# EAGLE design WaterMonitorV5.0 (EAGLE 7.4.0)
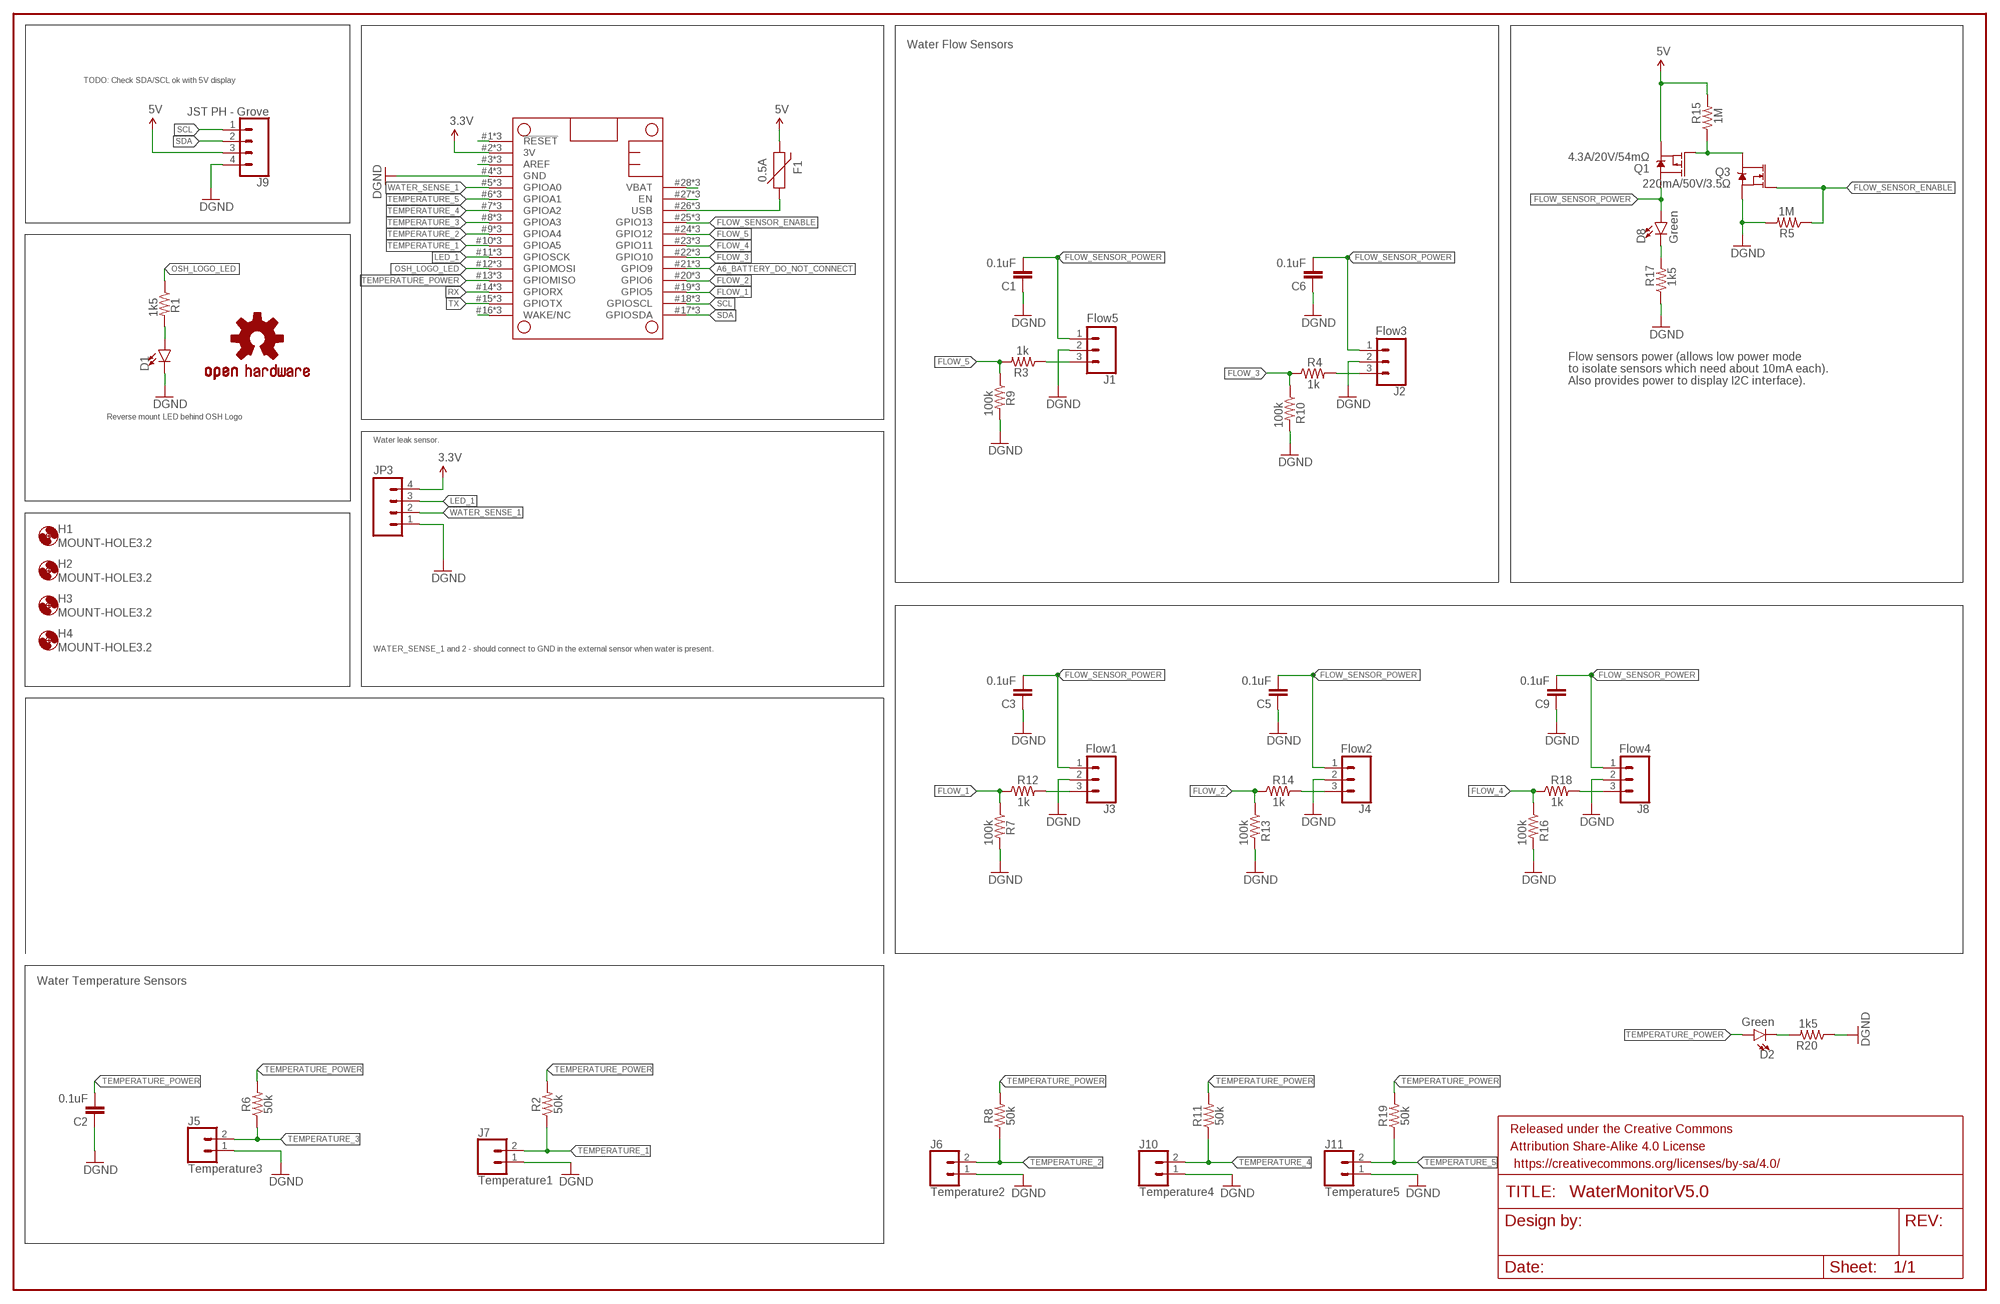
[diagram p0: schematic, sheet 1]

## Parts
C1  0.1uF  CAP0805  [0805]
C2  0.1uF  CAP0805  [0805]
C3  0.1uF  CAP0805  [0805]
C5  0.1uF  CAP0805  [0805]
C6  0.1uF  CAP0805  [0805]
C9  0.1uF  CAP0805  [0805]
D1  LED1206-BOTTOM  [LED-1206-BOTTOM]
D2  Green  LED-BLUE1206  [LED-1206]
D8  Green  LED-BLUE1206  [LED-1206]
F1  0.5A  PPTC_HALF-AMP  [1206]
FRAME2  FRAME-LEDGER  [CREATIVE_COMMONS]
H1  MOUNT-HOLE3.2  [3,2]
H2  MOUNT-HOLE3.2  [3,2]
H3  MOUNT-HOLE3.2  [3,2]
H4  MOUNT-HOLE3.2  [3,2]
J1  Flow5  CONN_03JST-HX-PTH-VERT  [JST-HX-3-PTH-VERT]
J2  Flow3  CONN_03JST-HX-PTH-VERT  [JST-HX-3-PTH-VERT]
J3  Flow1  CONN_03JST-HX-PTH-VERT  [JST-HX-3-PTH-VERT]
J4  Flow2  CONN_03JST-HX-PTH-VERT  [JST-HX-3-PTH-VERT]
J5  Temperature3  CONN_02POLAR  [MOLEX-1X2]
J6  Temperature2  CONN_02POLAR  [MOLEX-1X2]
J7  Temperature1  CONN_02POLAR  [MOLEX-1X2]
J8  Flow4  CONN_03JST-HX-PTH-VERT  [JST-HX-3-PTH-VERT]
J9  JST PH - Grove  CONN_04JST-PTH-VERT  [JST-4-PTH-VERT]
J10  Temperature4  CONN_02POLAR  [MOLEX-1X2]
J11  Temperature5  CONN_02POLAR  [MOLEX-1X2]
JP3  M04POLAR  [MOLEX-1X4@1]
LOGO1  OSHW-LOGOM  [OSHW-LOGO-M]
MS1  FEATHERWINGFEATHEWING_BREAKOUT  [FEATHERWING_BREAKOUT]
Q1  4.3A/20V/54mΩ  MOSFET_PCH-IRLML2244  [SOT23-3]
Q3  220mA/50V/3.5Ω  MOSFET-NCH-BSS138  [SOT23-3]
R1  1k5  RESISTOR0805  [0805]
R2  50k  RESISTOR0805  [0805]
R3  1k  RESISTOR0805  [0805]
R4  1k  RESISTOR0805  [0805]
R5  1M  RESISTOR0805  [0805]
R6  50k  RESISTOR0805  [0805]
R7  100k  RESISTOR0805  [0805]
R8  50k  RESISTOR0805  [0805]
R9  100k  RESISTOR0805  [0805]
R10  100k  RESISTOR0805  [0805]
R11  50k  RESISTOR0805  [0805]
R12  1k  RESISTOR0805  [0805]
R13  100k  RESISTOR0805  [0805]
R14  1k  RESISTOR0805  [0805]
R15  1M  RESISTOR0805  [0805]
R16  100k  RESISTOR0805  [0805]
R17  1k5  RESISTOR0805  [0805]
R18  1k  RESISTOR0805  [0805]
R19  50k  RESISTOR0805  [0805]
R20  1k5  RESISTOR0805  [0805]

## Nets
3.3V: JP3.4 MS1.2(3V) MS1.#2(3V) MS1.@2(3V)
5V: F1.2 J9.3 Q1.2(S) R15.2
A6_BATTERY_DO_NOT_CONNECT: MS1.21(GPIO9) MS1.#21(GPIO9) MS1.@21(GPIO9)
FLOW_1: MS1.19(GPIO5) MS1.#19(GPIO5) MS1.@19(GPIO5) R7.1 R12.1
FLOW_2: MS1.20(GPIO6) MS1.#20(GPIO6) MS1.@20(GPIO6) R13.1 R14.1
FLOW_3: MS1.22(GPIO10) MS1.#22(GPIO10) MS1.@22(GPIO10) R4.1 R10.1
FLOW_4: MS1.23(GPIO11) MS1.#23(GPIO11) MS1.@23(GPIO11) R16.1 R18.1
FLOW_5: MS1.24(GPIO12) MS1.#24(GPIO12) MS1.@24(GPIO12) R3.2 R9.1
FLOW_SENSOR_ENABLE: MS1.25(GPIO13) MS1.#25(GPIO13) MS1.@25(GPIO13) Q3.1(G) R5.1
FLOW_SENSOR_POWER: C1.2 C3.2 C5.2 C6.2 C9.2 D8.A J1.1 J2.1 J3.1 J4.1 J8.1 Q1.3(D)
GND: C1.1 C2.1 C3.1 C5.1 C6.1 C9.1 D1.C J1.2 J2.2 J3.2 J4.2 J5.1 J6.1 J7.1 J8.2 J9.4 J10.1 J11.1 JP3.1 MS1.4(GND) MS1.#4(GND) MS1.@4(GND) Q3.2(S) R5.2 R7.2 R9.2 R10.2 R13.2 R16.2 R17.1 R20.1 ; supply symbol labelled DGND
LED_1: JP3.3 MS1.11(GPIOSCK) MS1.#11(GPIOSCK) MS1.@11(GPIOSCK)
N$1: J3.3 R12.2
N$3: J1.3 R3.1
N$4: J2.3 R4.2
N$6: J4.3 R14.2
N$7: D8.C R17.2
N$11: D2.C R20.2
N$13: MS1.1(!RESET) MS1.#1(!RESET) MS1.@1(!RESET)
N$15: MS1.27(EN) MS1.#27(EN) MS1.@27(EN)
N$16: J8.3 R18.2
N$19: Q1.1(G) Q3.3(D) R15.1
N$20: MS1.3(AREF) MS1.#3(AREF) MS1.@3(AREF)
N$21: D1.A R1.2
N$47: MS1.16(WAKE/NC) MS1.#16(WAKE/NC) MS1.@16(WAKE/NC)
OSH_LOGO_LED: MS1.12(GPIOMOSI) MS1.#12(GPIOMOSI) MS1.@12(GPIOMOSI) R1.1
RX: MS1.14(GPIORX) MS1.#14(GPIORX) MS1.@14(GPIORX)
SCL: J9.1 MS1.18(GPIOSCL) MS1.#18(GPIOSCL) MS1.@!8(GPIOSCL)
SDA: J9.2 MS1.17(GPIOSDA) MS1.#17(GPIOSDA) MS1.@17(GPIOSDA)
TEMPERATURE_1: J7.2 MS1.10(GPIOA5) MS1.#10(GPIOA5) MS1.@10(GPIOA5) R2.1
TEMPERATURE_2: J6.2 MS1.9(GPIOA4) MS1.#9(GPIOA4) MS1.@9(GPIOA4) R8.1
TEMPERATURE_3: J5.2 MS1.8(GPIOA3) MS1.#8(GPIOA3) MS1.@8(GPIOA3) R6.1
TEMPERATURE_4: J10.2 MS1.7(GPIOA2) MS1.#7(GPIOA2) MS1.@7(GPIOA2) R11.1
TEMPERATURE_5: J11.2 MS1.6(GPIOA1) MS1.#6(GPIOA1) MS1.@6(GPIOA1) R19.1
TEMPERATURE_POWER: C2.2 D2.A MS1.13(GPIOMISO) MS1.#13(GPIOMISO) MS1.@13(GPIOMISO) R2.2 R6.2 R8.2 R11.2 R19.2
TX: MS1.15(GPIOTX) MS1.#15(GPIOTX) MS1.@15(GPIOTX)
USB: F1.1 MS1.26(USB) MS1.#26(USB) MS1.@26(USB)
VBAT: MS1.28(VBAT) MS1.#28(VBAT) MS1.@28(VBAT)
WATER_SENSE_1: JP3.2 MS1.5(GPIOA0) MS1.#5(GPIOA0) MS1.@5(GPIOA0)

## Notes on the sheet
- Water Flow Sensors
- TODO: Check SDA/SCL ok with 5V display
- Flow sensors power (allows low power mode 
  to isolate sensors which need about 10mA each).
  Also provides power to display I2C interface).
- Reverse mount LED behind OSH Logo
- Water leak sensor.
- WATER_SENSE_1 and 2 - should connect to GND in the external sensor when water is present.
- Water Temperature Sensors

## Library data of the parts
C1-C3 C5 C6 C9 = SparkFun-Passives:CAP: Capacitor Standard 0603 ceramic capacitor, and 0.1" leaded capacitor.
D1 = SparkFun-LED:LED: LED (Generic) Standard schematic elements and footprints for 5mm, 3mm, 1206, and 0603 sized LEDs. Generic LEDs with no color specified.
D2 D8 = SparkFun-LED:LED-BLUE: Blue SMD LED Used in manufacturing of various products at SparkFun Packages: 0603 - SMD 0603 package [Product Link] <http://www.digikey.com/product-detail/en/SMLE12BC7TT86/511-1589-2-ND/1641808> 1206 - SMD1206 package [Product Link] <http://www.digikey.com/product-detail/en/lite-on-inc/LTST-C150TBKT/160-1643-1-ND/573584> SparkFun Products: ESP8266 Thing-Dev Board <https://www.sparkfun.com/products/13711> RedBoard <https://www.sparkfun.com/products/12757>; PROD_ID: DIO-09911; VALUE: BLUE
F1 = SparkFun-Fuses:PPTC: Resettable Fuse PPTC Resettable Fuse. Really a sort of resistor with a polymeric positive temperature coefficient whose resistance increases dramatically with an increase in temperature. When heated by the power passing through the resistance rises causing the current to be limited, protecting the circuit. This is achieved by the transition of the polymer from a crystalline to an amorphous state where the conductive carbon separates breaking the conductive pathways found in the cool crystalline structure. When a PPTC cools back down it resumes conducting letting the circuit turn back on. SparkFun Products: SparkFun RedBoard - Programmed with Arduino <https://www.sparkfun.com/products/12757> Pro Micro - 5V/16MHz <https://www.sparkfun.com/products/12640> Arduino Pro 328 - 5V/16MHz <https://www.sparkfun.com/products/10915> MP3 Trigger <https://www.sparkfun.com/products/13720>; PROD_ID: RES-08585; VALUE: 6V/0.5A
FRAME2 = SparkFun-Aesthetics:FRAME-LEDGER: Schematic Frame Standard 11x14 US Ledger frame
H1-H4 = holes:MOUNT-HOLE: MOUNTING HOLE with drill center marker
J1-J4 J8 = Tinamous:CONN_03: Multi connection point. Often used as Generic Header-pin footprint for 0.1 inch spaced/style header connections On any of the 0.1 inch spaced packages, you can populate with these: Break Away Headers - Straight <https://www.sparkfun.com/products/116> (PRT-00116) Break Away Male Headers - Right Angle <https://www.sparkfun.com/products/553> (PRT-00553) Female Headers <https://www.sparkfun.com/products/115> (PRT-00115) Break Away Headers - Machine Pin <https://www.sparkfun.com/products/117> (PRT-00117) Break Away Female Headers - Swiss Machine Pin <https://www.sparkfun.com/products/743> (PRT-00743) Stackable Header - 3 Pin (Female, 0.1") <https://www.sparkfun.com/products/13875> (PRT-13875) For SCREWTERMINALS and SPRING TERMINALS visit here: Screw Terimnals on SparkFun.com <https://www.sparkfun.com/search/results?term=Screw+Terminals> (5mm/3.5mm/2.54mm spacing) This device is also useful as a general connection point to wire up your design to another part of your project. Our various solder wires solder well into these plated through hole pads. Hook-Up Wire - Assortment (Stranded, 22 AWG) <https://www.sparkfun.com/products/11375> (PRT-11375) Hook-Up Wire - Assortment (Solid Core, 22 AWG) <https://www.sparkfun.com/products/11367> (PRT-11367) View the entire wire category on our website here <https://www.sparkfun.com/categories/141> Special notes: Molex polarized connector foot print use with SKU : PRT-08232 with associated crimp pins and housings.
J5-J7 J10 J11 = SparkFun-Connectors:CONN_02: Multi connection point. Often used as Generic Header-pin footprint for 0.1 inch spaced/style header connections On any of the 0.1 inch spaced packages, you can populate with these: Break Away Headers - Straight <https://www.sparkfun.com/products/116> (PRT-00116) Break Away Male Headers - Right Angle <https://www.sparkfun.com/products/553> (PRT-00553) Female Headers <https://www.sparkfun.com/products/115> (PRT-00115) Break Away Headers - Machine Pin <https://www.sparkfun.com/products/117> (PRT-00117) Break Away Female Headers - Swiss Machine Pin <https://www.sparkfun.com/products/743> (PRT-00743) For SCREWTERMINALS and SPRING TERMINALS visit here: Screw Terimnals on SparkFun.com <https://www.sparkfun.com/search/results?term=Screw+Terminals> (5mm/3.5mm/2.54mm spacing) This device is also useful as a general connection point to wire up your design to another part of your project. Our various solder wires solder well into these plated through hole pads. Hook-Up Wire - Assortment (Stranded, 22 AWG) <https://www.sparkfun.com/products/11375> (PRT-11375) Hook-Up Wire - Assortment (Solid Core, 22 AWG) <https://www.sparkfun.com/products/11367> (PRT-11367) View the entire wire category on our website here <https://www.sparkfun.com/categories/141> Special notes: Molex polarized connector foot print use with: PRT-08233 with associated crimp pins and housings. 2.54_SCREWTERM for use with PRT-10571. 3.5mm Screw Terminal footprints for PRT-08084 5mm Screw Terminal footprints for use with PRT-08432; SF_ID: PRT-09918
J9 = SparkFun-Connectors:CONN_04: Multi connection point. Often used as Generic Header-pin footprint for 0.1 inch spaced/style header connections On any of the 0.1 inch spaced packages, you can populate with these: Break Away Headers - Straight <https://www.sparkfun.com/products/116> (PRT-00116) Break Away Male Headers - Right Angle <https://www.sparkfun.com/products/553> (PRT-00553) Female Headers <https://www.sparkfun.com/products/115> (PRT-00115) Break Away Headers - Machine Pin <https://www.sparkfun.com/products/117> (PRT-00117) Break Away Female Headers - Swiss Machine Pin <https://www.sparkfun.com/products/743> (PRT-00743) For SCREWTERMINALS and SPRING TERMINALS visit here: Screw Terimnals on SparkFun.com <https://www.sparkfun.com/search/results?term=Screw+Terminals> (5mm/3.5mm/2.54mm spacing) This device is also useful as a general connection point to wire up your design to another part of your project. Our various solder wires solder well into these plated through hole pads. Hook-Up Wire - Assortment (Stranded, 22 AWG) <https://www.sparkfun.com/products/11375> (PRT-11375) Hook-Up Wire - Assortment (Solid Core, 22 AWG) <https://www.sparkfun.com/products/11367> (PRT-11367) View the entire wire category on our website here <https://www.sparkfun.com/categories/141> Special notes: Molex polarized connector foot print use with SKU : PRT-08231 with associated crimp pins and housings. 1MM SMD Version SKU: PRT-10208; PROD_ID: CONN-13251
JP3 = SparkFun-Connectors:M04: Header 4 Standard 4-pin 0.1" header. Use with straight break away headers (SKU : PRT-00116), right angle break away headers (PRT-00553), swiss pins (PRT-00743), machine pins (PRT-00117), and female headers (PRT-00115). Molex polarized connector foot print use with SKU : PRT-08231 with associated crimp pins and housings. 1MM SMD Version SKU: PRT-10208
LOGO1 = SparkFun-Aesthetics:OSHW-LOGO: Open Source Hardware Logo This logo indicates the piece of hardware it is found on incorporates a OSHW license and/or adheres to the definition of open source hardware found here: http://freedomdefined.org/OSHW
MS1 = ThingySticks:FEATHERWING
Q1 = SparkFun-DiscreteSemi:MOSFET_PCH: P-channel MOSFETs Voltage controlled devices that allow control of high current outputs. SparkFun Products: SparkFun ESP32 Thing <https://www.sparkfun.com/products/13907> SparkFun ESP8266 Thing <https://www.sparkfun.com/products/13231>; PROD_ID: TRANS-11153
Q3 = SparkFun-DiscreteSemi:MOSFET-NCH: N-channel MOSFETs Voltage controlled devices that allow control of high current outputs. SparkFun Products: SparkFun OpenScale <https://www.sparkfun.com/products/13261> SparkFun Digital Sandbox <https://www.sparkfun.com/products/12651> SparkFun Monster Moto Shield <https://www.sparkfun.com/products/10182> SparkFun MOSFET Power Controller <https://www.sparkfun.com/products/11214>; PROD_ID: TRANS-00830
R1-R20 = SparkFun-Resistors:RESISTOR: Generic Resistor Package

## Board
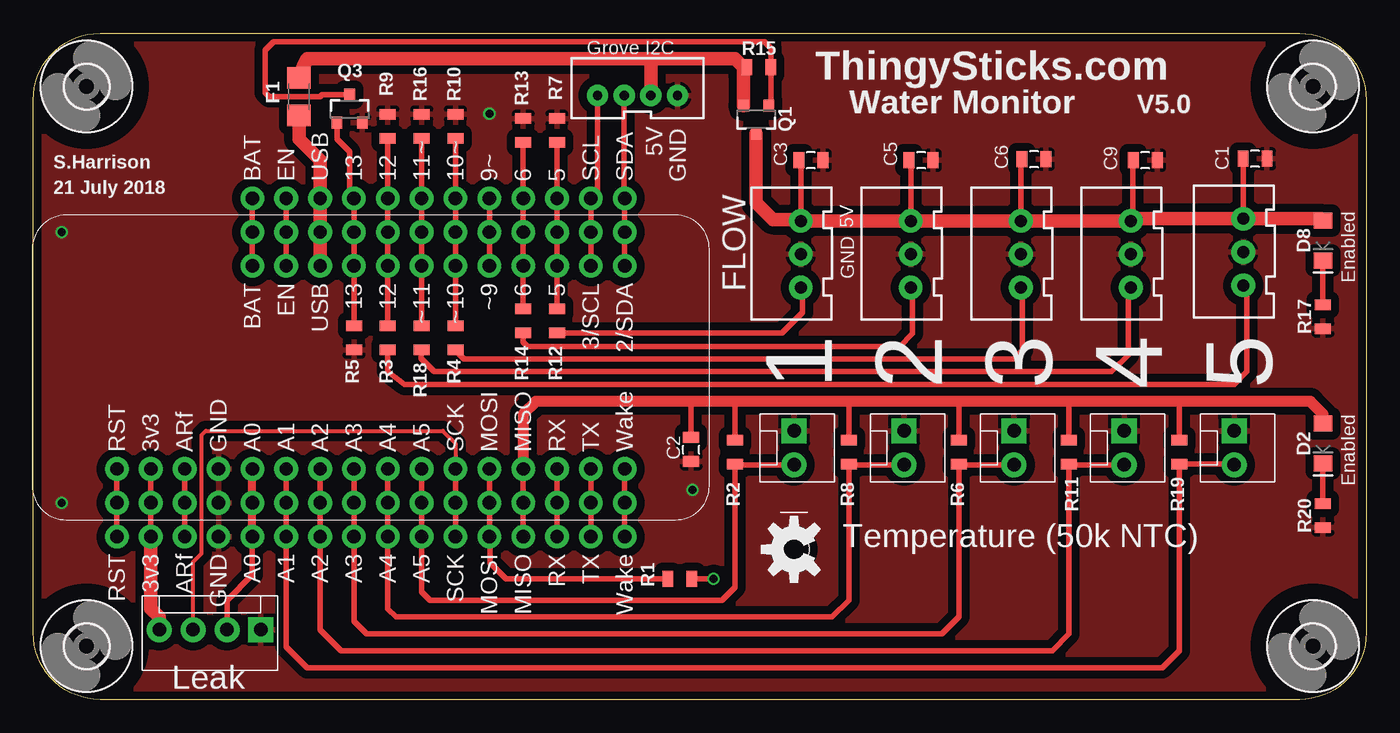
[diagram p1: board, top side]
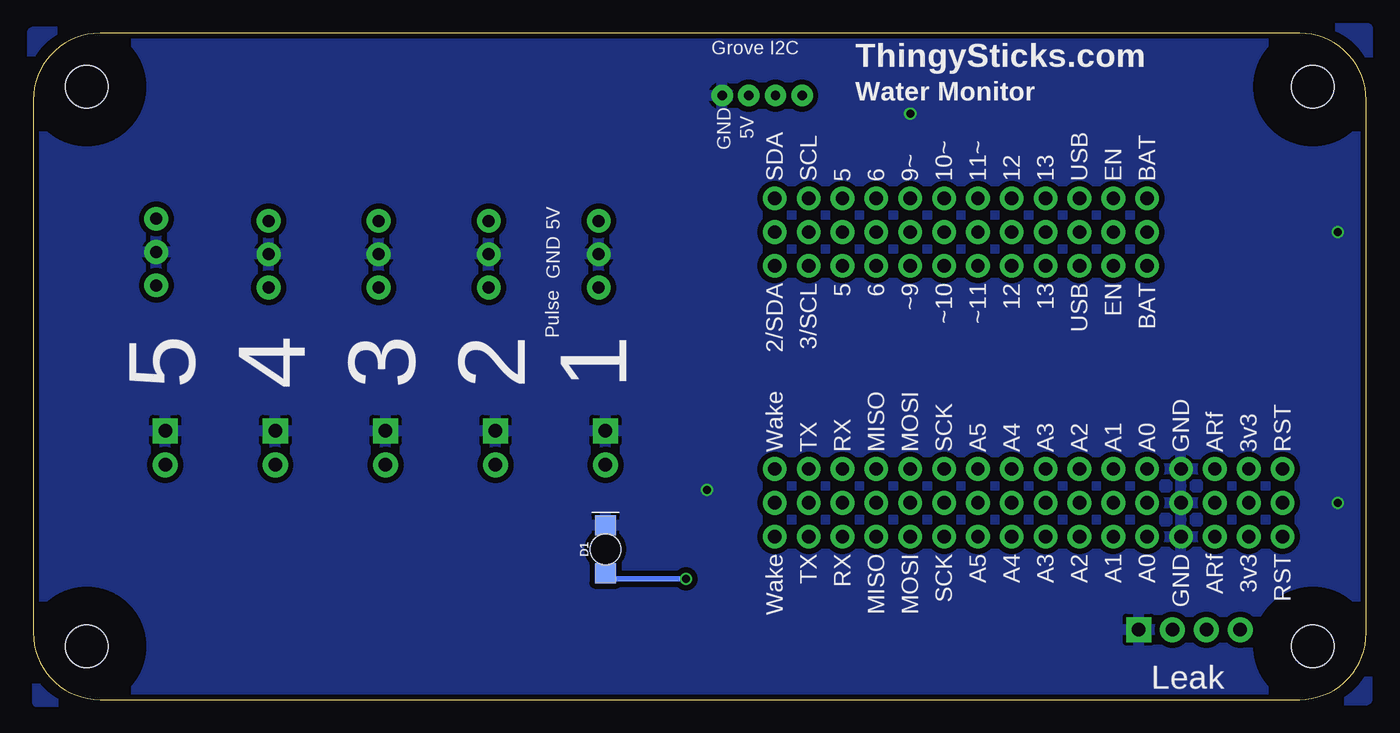
[diagram p2: board, bottom side, seen from below]

Size 100 x 50 mm. Coordinates in mm from the lower left corner, seen from the top.
Outline: 5,50 95,50 arc-90 100,45 100,5 arc-90 95,0 5,0 arc-90 0,5 0,45 arc-90 5,50
Copper layers (1*16): Top 0.035mm / dielectric 1.5mm / Bottom 0.035mm
Design rules "dirt_cheap_dirty_boards.v1": minimum track width 5mil, minimum drill 12mil, track to track 5mil, track to pad 5mil, pad to pad 5mil, via to via 5mil, smd to smd 0mil, copper to edge 10mil, drill to drill 10mil, minimum pad ring 10mil, minimum via ring 6mil, stop-mask expansion 2mil, vias tented up to drill 25mil, thermal gap 10mil

### Footprints (pad centres in the part's own frame; a part is rotated, then mirrored left to right if it is on the bottom)
0805 = smd 0.8 x 1.2: 1 -0.9,0; 2 0.9,0
LED-1206-BOTTOM = smd 1.5 x 1.6: A -1.8,0; C 1.8,0 | hole 2.3: 0,0
LED-1206 = smd 1.2 x 1.4: A -1.5,0; C 1.5,0
1206 = smd 1.6 x 1.8: 1 -1.4,0; 2 1.4,0
3,2 = hole 3.2: 0,0
JST-HX-3-PTH-VERT = drill 0.9 pad 1.778: 1 7.5,2.35; 2 5,2.35; 3 2.5,2.35
MOLEX-1X2 = drill 1.016 pad 1.88 square: 1 0,0 | drill 1.016 pad 1.88: 2 2.54,0
JST-4-PTH-VERT = drill 0.7 pad 1.6: 1 -3,-0.55; 2 -1,-0.55; 3 1,-0.55; 4 3,-0.55
MOLEX-1X4@1 = drill 1.016 pad 1.88 square: 1 0,0 | drill 1.016 pad 1.88: 2 2.54,0; 3 5.08,0; 4 7.62,0
FEATHERWING_BREAKOUT = drill 1 pad 1.778: 1 6.35,1.27; 2 8.89,1.27; 3 11.43,1.27; 4 13.97,1.27; 5 16.51,1.27; 6 19.05,1.27; 7 21.59,1.27; 8 24.13,1.27; 9 26.67,1.27; 10 29.21,1.27; 11 31.75,1.27; 12 34.29,1.27; 13 36.83,1.27; 14 39.37,1.27; 15 41.91,1.27; 16 44.45,1.27; 17 44.45,21.59; 18 41.91,21.59; 19 39.37,21.59; 20 36.83,21.59; 21 34.29,21.59; 22 31.75,21.59; 23 29.21,21.59; 24 26.67,21.59; 25 24.13,21.59; 26 21.59,21.59; 27 19.05,21.59; 28 16.51,21.59; #1 6.35,3.81; #2 8.89,3.81; #3 11.43,3.81; #4 13.97,3.81; #5 16.51,3.81; #6 19.05,3.81; #7 21.59,3.81; #8 24.13,3.81; #9 26.67,3.81; #10 29.21,3.81; #11 31.75,3.81; #12 34.29,3.81; #13 36.83,3.81; #14 39.37,3.81; #15 41.91,3.81; #16 44.45,3.81; #17 44.45,19.05; #18 41.91,19.05; #19 39.37,19.05; #20 36.83,19.05; #21 34.29,19.05; #22 31.75,19.05; #23 29.21,19.05; #24 26.67,19.05; #25 24.13,19.05; #26 21.59,19.05; #27 19.05,19.05; #28 16.51,19.05; @1 6.35,-1.27; @2 8.89,-1.27; @3 11.43,-1.27; @4 13.97,-1.27; @5 16.51,-1.27; @6 19.05,-1.27; @7 21.59,-1.27; @8 24.13,-1.27; @9 26.67,-1.27; @10 29.21,-1.27; @11 31.75,-1.27; @12 34.29,-1.27; @13 36.83,-1.27; @14 39.37,-1.27; @15 41.91,-1.27; @16 44.45,-1.27; @17 44.45,24.13; @19 39.37,24.13; @20 36.83,24.13; @21 34.29,24.13; @22 31.75,24.13; @23 29.21,24.13; @24 26.67,24.13; @25 24.13,24.13; @26 21.59,24.13; @27 19.05,24.13; @28 16.51,24.13; @!8 41.91,24.13
SOT23-3 = smd 0.8 x 0.9: 1 -0.95,-1; 2 0.95,-1; 3 0,1.1

### Placement (x,y rotation side)
C1  91.66,40.58 180 top
C2  49.36,18.77 90 top
C3  58.34,40.48 180 top
C5  66.6,40.48 180 top
C6  75.07,40.55 180 top
C9  83.42,40.48 180 top
D1  57.07,11.27 90 bottom
D2  96.76,19.21 270 top
D8  96.76,34.45 270 top
F1  19.92,45.24 90 top
FRAME2  16.75,-12.23 0 top  (outside the outline)
H1  4,46 0 top
H2  96,4 0 top
H3  96,46 0 top
H4  4,4 0 top
J1  93.13,28.58 90 top
J2  76.44,28.41 90 top
J3  59.93,28.41 90 top
J4  68.19,28.41 90 top
J5  73.58,20.16 270 top
J6  65.33,20.16 270 top
J7  57.07,20.16 270 top
J8  84.69,28.41 90 top
J9  45.33,45.88 0 top
J10  81.84,20.16 270 top
J11  90.09,20.16 270 top
JP3  17.07,5.24 180 top
LOGO1  57.07,11.27 90 top
MS1  -0.08,13.49 0 top
Q1  54.23,43.55 180 top
Q3  23.73,44.29 0 top
R1  48.5,9.05 0 top
R2  52.63,18.57 90 top
R3  26.59,27.14 90 top
R4  31.67,27.14 270 top
R5  24.05,27.14 270 top
R6  69.45,18.57 90 top
R7  39.29,42.7 90 top
R8  61.2,18.57 90 top
R9  26.59,43.02 90 top
R10  31.67,43.02 90 top
R11  77.71,18.57 90 top
R12  39.29,28.41 270 top
R13  36.75,42.7 90 top
R14  36.75,28.41 270 top
R15  54.43,47.45 180 top
R16  29.13,43.02 90 top
R17  96.76,28.73 90 top
R18  29.13,27.14 270 top
R19  85.97,18.57 90 top
R20  96.76,13.81 90 top

### Tracks (layer width: path | path; a pad name or v marks a point on that pad's centre or on a via)
3.3V
  Top 0.406: MS1.@2 MS1.2 MS1.#2
  Top 1.016: JP3.4 9.45,6.19 8.81,6.83 MS1.@2
5V
  Top 0.406: R15.2 53.53,47.1 53.26,46.83
  Top 1.016: F1.2 19.92,46.83 20.56,48.1 46.59,48.1 | 46.59,48.1 52.63,48.1 53.26,47.47 53.26,46.83 53.26,44.58 Q1.2 | J9.3 46.33,47.83 46.59,48.1
A6_BATTERY_DO_NOT_CONNECT
  Top 0.406: MS1.@21 MS1.21 MS1.#21
FLOW_1
  Top 0.406: R12.1 MS1.#19 MS1.19 MS1.@19 R7.1
FLOW_2
  Top 0.406: R13.1 MS1.@20 MS1.20 MS1.#20 R14.1
FLOW_3
  Top 0.406: R4.1 MS1.#22 MS1.22 MS1.@22 R10.1
FLOW_4
  Top 0.406: R18.1 MS1.#23 MS1.23 MS1.@23 R16.1
FLOW_5
  Top 0.406: R3.2 MS1.#24 MS1.24 MS1.@24 R9.1
FLOW_SENSOR_ENABLE
  Top 0.406: Q3.1 22.78,42.06 23.73,41.11 23.73,37.94 MS1.@25 MS1.25 MS1.#25 R5.1
FLOW_SENSOR_POWER
  Top 0.406: J3.1 57.58,40.34 C3.2 | J4.1 65.83,40.34 C5.2 | J2.1 74.09,40.46 C6.2 | 82.51,36.08 82.51,40.47 C9.2 | J1.1 90.78,40.56 C1.2
  Top 1.016: D8.A 96.63,36.08 J1.1 82.51,36.08 J8.1 J2.1 J4.1 J3.1 57.46,36.03 55.48,36.03 54.23,37.28 Q1.3
GND  (via drill 0.6)
  other vias: 2.14,14.76 2.14,35.08 34.21,43.97 49.45,15.71
  pour Bottom (isolate 0.406, rank 6): -0.11,50.37 100.07,50.07 99.69,-0.18 8.57,-0.08 -0.06,0
  pour Top (isolate 0.61, rank 6): -0.1,50.41 100.05,50.08 99.83,-0.13 0.01,-0.41
LED_1
  Top 0.305: JP3.3 11.99,10.32 12.62,10.95 12.62,19.84 12.94,20.16 30.72,20.16 31.67,19.21 MS1.#11
  Top 0.406: MS1.@11 MS1.11 MS1.#11
N$1
  Top 0.406: R12.2 56.17,27.52 57.71,29.05 57.71,30.79 J3.3
N$3
  Top 0.406: R3.1 26.59,24.61 27.86,23.65 90.09,23.65 91.05,24.61 91.05,30.81 J1.3
N$4
  Top 0.406: R4.2 31.67,26.19 32.31,25.56 73.58,25.56 74.22,26.19 74.22,30.79 J2.3
N$6
  Top 0.406: R14.2 36.75,26.83 37.07,26.51 65.01,26.51 65.96,27.46 65.96,30.79 J4.3
N$7
  Top 0.406: D8.C R17.2
N$11
  Top 0.406: D2.C R20.2
N$13
  Top 0.406: MS1.#1 MS1.1 MS1.@1
N$15
  Top 0.406: MS1.#27 MS1.27 MS1.@27
N$16
  Top 0.406: R18.2 29.08,25.61 30.09,24.61 80.89,24.61 82.16,25.88 82.16,30.73 J8.3
N$19
  Top 0.406: Q1.1 55.33,44.7 R15.1 55.33,48.89 54.85,49.37 18.02,49.37 17.38,48.73 17.38,45.56 17.7,45.24 21.51,45.24 21.66,45.39 Q3.3
N$20
  Top 0.406: MS1.#3 MS1.3 MS1.@3
N$21  (via drill 0.6)
  Top 0.406: R1.2 v51.04,9.05
  Bottom 0.406: v51.04,9.05 56.33,9.05 D1.A
N$47
  Top 0.406: MS1.#16 MS1.16 MS1.@16
OSH_LOGO_LED
  Top 0.406: MS1.#12 MS1.12 MS1.@12 34.27,12.17 34.27,10.27 35.48,9.05 R1.1
RX
  Top 0.406: MS1.#14 MS1.14 MS1.@14
SCL
  Top 0.406: MS1.#18 MS1.18 MS1.@!8 42.33,38.11 J9.1
  Bottom 0.406: 42.33,38.11 MS1.@!8
SDA
  Top 0.406: MS1.#17 MS1.17 MS1.@17 44.33,37.67 J9.2
TEMPERATURE_1
  Top 0.406: J7.2 52.68,17.62 R2.1 52.63,8.41 51.67,7.46 29.77,7.46 29.13,8.1 MS1.@10 MS1.10 MS1.#10
TEMPERATURE_2
  Top 0.406: J6.2 61.25,17.62 R8.1 61.2,7.46 59.93,6.19 27.23,6.19 26.59,6.83 MS1.@9 MS1.9 MS1.#9
TEMPERATURE_3
  Top 0.406: J5.2 69.51,17.62 R6.1 69.45,6.19 68.19,4.92 25.01,4.92 24.05,5.87 MS1.@8 MS1.8 MS1.#8
TEMPERATURE_4
  Top 0.406: J10.2 77.76,17.62 R11.1 77.71,4.92 76.44,3.65 23.1,3.65 21.51,5.24 MS1.@7 MS1.7 MS1.#7
TEMPERATURE_5
  Top 0.406: J11.2 90.04,17.67 R19.1 85.97,3.65 84.69,2.38 20.56,2.38 18.97,3.97 MS1.@6 MS1.6 MS1.#6
TEMPERATURE_POWER
  Top 0.406: MS1.@13 MS1.13 MS1.#13 | R2.2 52.63,22.38 | R8.2 61.2,22.38 | R6.2 69.45,22.38 | R11.2 77.71,22.38 | R19.2 85.97,22.38 | C2.2 49.36,22.29 49.77,22.38
  Top 0.813: D2.A 96.76,21.43 95.81,22.38 85.97,22.38 77.71,22.38 69.45,22.38 61.2,22.38 52.63,22.38 49.77,22.38 37.7,22.38 36.75,21.43 MS1.#13
TX
  Top 0.406: MS1.@15 MS1.15 MS1.#15
USB
  Top 1.016: MS1.#26 MS1.26 MS1.@26 21.51,40.48 19.92,42.07 F1.1
VBAT
  Top 0.406: MS1.@28 MS1.28 MS1.#28
WATER_SENSE_1
  Top 0.406: JP3.2 14.53,7.46 16.43,9.37 MS1.@5
  Top 0.61: MS1.@5 MS1.5 MS1.#5

### Text on the board
tNames: Grove I2C | ThingySticks.com | Water Monitor | V5.0 | 5V | GND | S.Harrison | 21 July 2018 | GND | 5V | FLOW | Enabled | 1 | 2 | 3 | 4 | 5 | Enabled | Temperature (50k NTC) | Leak
bNames: Grove I2C | ThingySticks.com | Water Monitor | 5V | GND | 5V | GND | Pulse | 1 | 2 | 3 | 4 | 5 | Leak